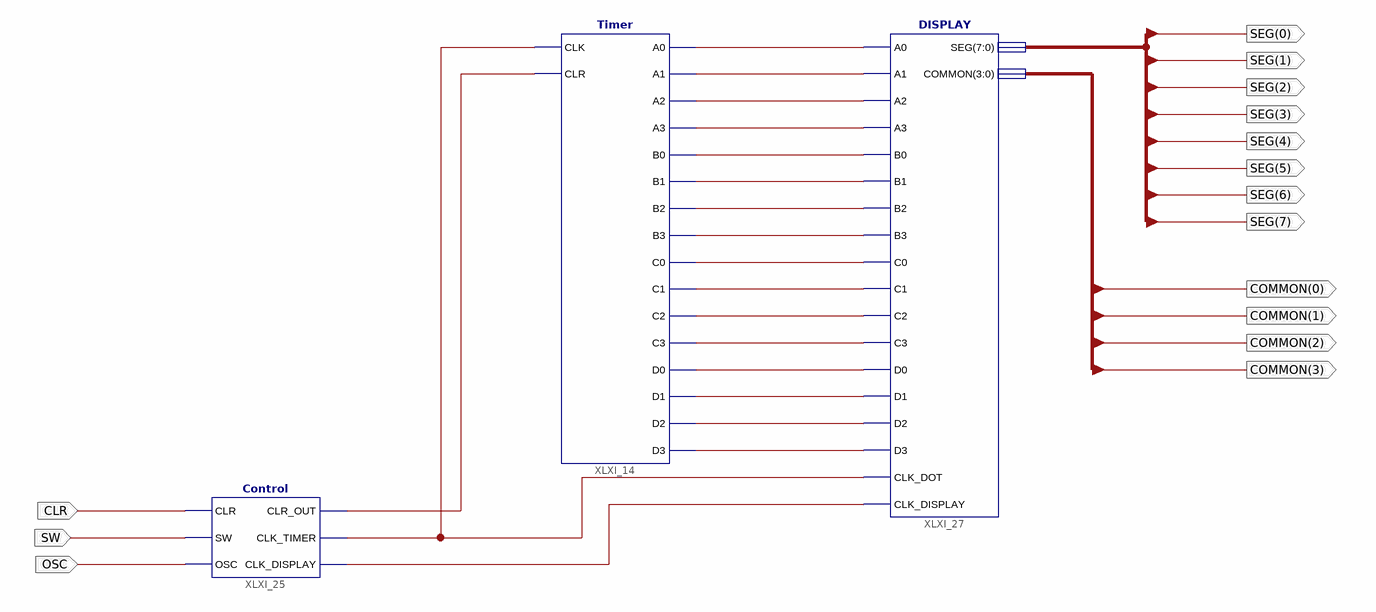
[diagram p0: schematic sheet 1]
// Xilinx ISE schematic main.sch (spartan6) as structural Verilog: 3 symbols, 15 ports
module main (
  input  CLR,
  input  SW,
  input  OSC,
  output [7:0] SEG,
  output [3:0] COMMON
);

  wire XLXN_1, XLXN_2, XLXN_3, XLXN_4, XLXN_5, XLXN_6, XLXN_7, XLXN_8, XLXN_9, XLXN_10, XLXN_11, XLXN_12,
       XLXN_13, XLXN_14, XLXN_15, XLXN_16, XLXN_86, XLXN_93, XLXN_95;

  Timer XLXI_14 (
    .A0(XLXN_1), .A1(XLXN_2), .A2(XLXN_3), .A3(XLXN_4), .B0(XLXN_5), .B1(XLXN_6), .B2(XLXN_7), .B3(XLXN_8),
    .C0(XLXN_9), .C1(XLXN_10), .C2(XLXN_11), .C3(XLXN_12), .CLK(XLXN_93), .CLR(XLXN_86), .D0(XLXN_13),
    .D1(XLXN_14), .D2(XLXN_15), .D3(XLXN_16));
  Control XLXI_25 (.CLK_DISPLAY(XLXN_95), .CLK_TIMER(XLXN_93), .CLR(CLR), .CLR_OUT(XLXN_86), .OSC(OSC), .SW(SW));
  DISPLAY XLXI_27 (
    .A0(XLXN_1), .A1(XLXN_2), .A2(XLXN_3), .A3(XLXN_4), .B0(XLXN_5), .B1(XLXN_6), .B2(XLXN_7), .B3(XLXN_8),
    .C0(XLXN_9), .C1(XLXN_10), .C2(XLXN_11), .C3(XLXN_12), .CLK_DISPLAY(XLXN_95), .CLK_DOT(XLXN_93),
    .COMMON(COMMON), .D0(XLXN_13), .D1(XLXN_14), .D2(XLXN_15), .D3(XLXN_16), .SEG(SEG[6:0]));

  // Notes on the sheet:
  //   LOC on signal CLR = P47
  //   CLOCK_DEDICATED_ROUTE on signal SW = TRUE
  //   LOC on signal SW = P45
  //   LOC on signal OSC = P123
  //   LOC on signal SEG(6) = P27
  //   LOC on signal SEG(5) = P29
  //   LOC on signal SEG(4) = P32
  //   LOC on signal SEG(3) = P34
  //   LOC on signal SEG(2) = P35
  //   LOC on signal SEG(1) = P40
  //   LOC on signal SEG(0) = P41
  //   LOC on signal COMMON(1) = P43
  //   LOC on signal COMMON(2) = P33
  //   LOC on signal COMMON(3) = P30
  //   LOC on signal COMMON(0) = P44
  //   LOC on signal SEG(7) = P26
endmodule
